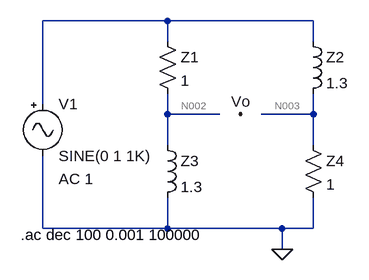
[diagram p0: schematic TS5-Ej1-Circuito Pasivo.asc]
TS5-Ej1-Circuito Pasivo.asc, the LTspice schematic file:
Version 4
SHEET 1 880 680
WIRE 160 96 -32 96
WIRE 384 96 160 96
WIRE 160 128 160 96
WIRE 384 128 384 96
WIRE -32 224 -32 96
WIRE 160 240 160 208
WIRE 240 240 160 240
WIRE 384 240 384 208
WIRE 384 240 304 240
WIRE 160 288 160 240
WIRE 384 288 384 240
WIRE -32 416 -32 304
WIRE 160 416 160 368
WIRE 160 416 -32 416
WIRE 336 416 160 416
WIRE 384 416 384 368
WIRE 384 416 336 416
WIRE 336 448 336 416
FLAG 272 240 Vo
FLAG 336 448 0
SYMBOL res 144 112 R0
SYMATTR InstName Z1
SYMATTR Value 1
SYMBOL ind 144 272 R0
SYMATTR InstName Z3
SYMATTR Value 1.3
SYMBOL ind 368 112 R0
SYMATTR InstName Z2
SYMATTR Value 1.3
SYMBOL res 368 272 R0
SYMATTR InstName Z4
SYMATTR Value 1
SYMBOL Misc\\signal -32 208 R0
WINDOW 123 24 132 Left 2
WINDOW 39 0 0 Left 0
SYMATTR InstName V1
SYMATTR Value2 AC 1
TEXT -66 426 Left 2 !.ac dec 100 0.001 100000

The netlist it stands for:
* TS5-Ej1-Circuito Pasivo.asc
R§Z1 N001 N002 1
L§Z3 N002 0 1.3
L§Z2 N001 N003 1.3
R§Z4 N003 0 1
V1 N001 0 SINE(0 1 1K) AC 1
.ac dec 100 0.001 100000
.backanno
.end

* Results of the author's LTspice run, read from the files saved beside the schematic
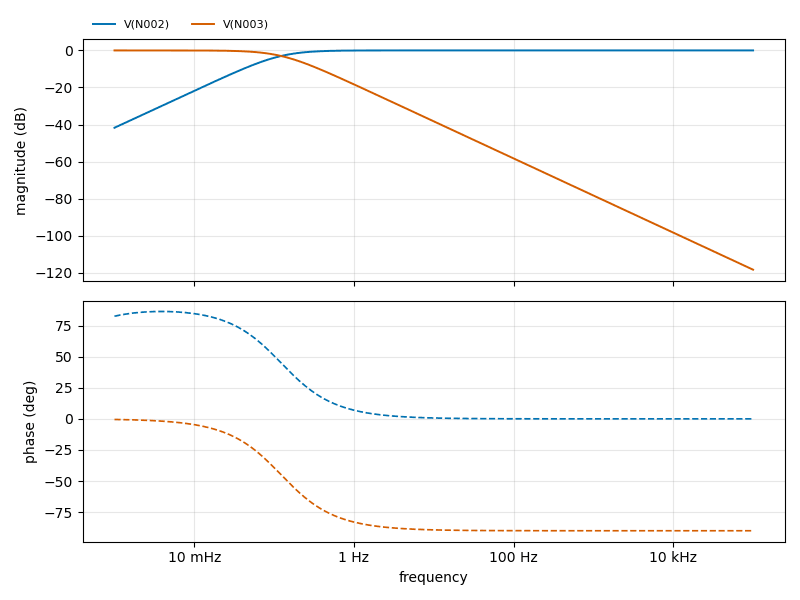
[diagram p1: AC Analysis of TS5-Ej1-Circuito Pasivo.asc, plotted from the saved traces]
* AC Analysis, 1 run:
*   V(N002): -41.70 dB at 1 mHz, -0.00 dB at 100 kHz, peak -0.00 dB at 100 kHz, 3 dB below the peak at 122.6 mHz
*   V(N003): -0.01 dB at 1 mHz, -118.24 dB at 100 kHz, peak -0.01 dB at 1 mHz, 3 dB below the peak at 122.6 mHz